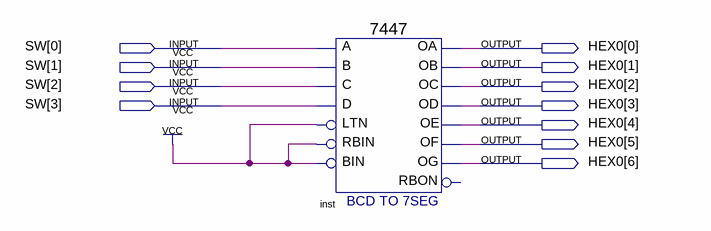
[diagram p0: schematic sheet]
// Quartus schematic BCD_T.bdf as structural Verilog: 1 symbols, 11 pins
module BCD_T (
  input  [3:0] SW,
  output [6:0] HEX0
);

  \7447  inst (
    .LTN(1'b1), .B(SW[1]), .C(SW[2]), .D(SW[3]), .RBIN(1'b1), .BIN(1'b1), .A(SW[0]), .OB(HEX0[1]),
    .OC(HEX0[2]), .OE(HEX0[4]), .OD(HEX0[3]), .OF(HEX0[5]), .OG(HEX0[6]), .OA(HEX0[0]));  // open: RBON
endmodule
